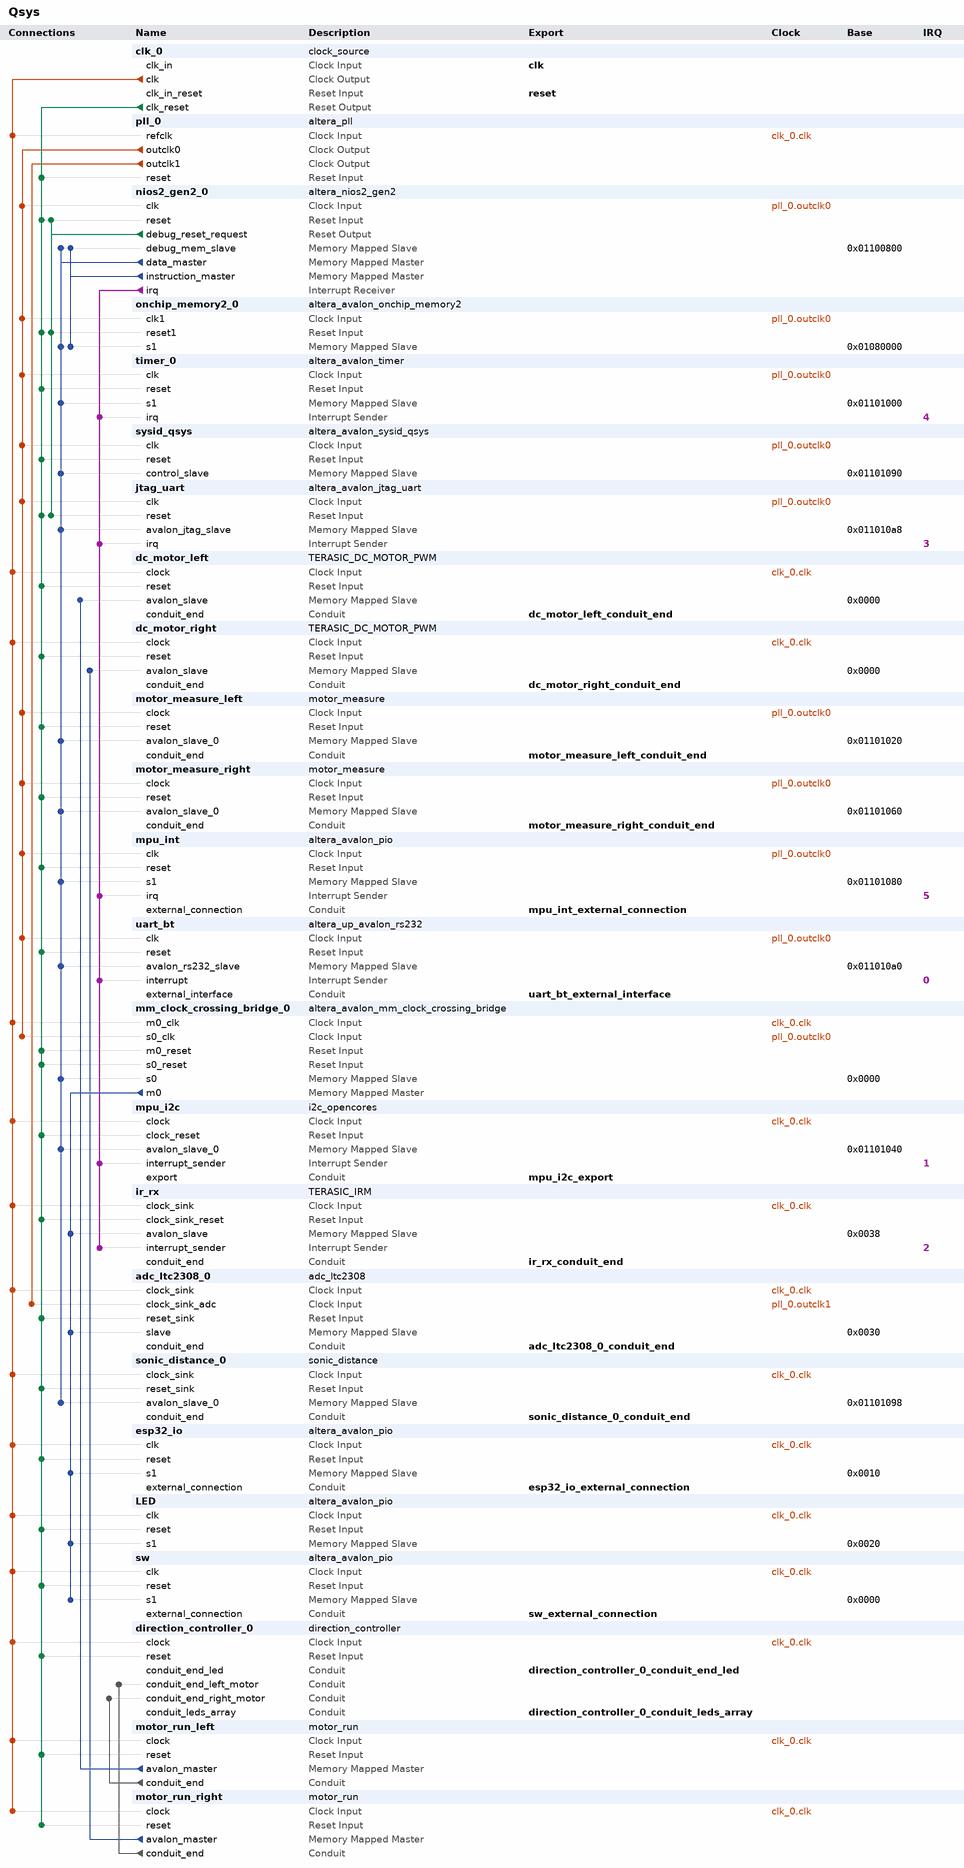
[diagram p0: system contents]
# Platform Designer (Qsys) system Qsys, Cyclone V 5CSEBA6U23I7
# Parameters at their usual value, and those the tool derives, are not listed.
package require -exact qsys 18.1
create_system Qsys
set_project_property DEVICE_FAMILY {Cyclone V}
set_project_property DEVICE 5CSEBA6U23I7

add_instance clk_0 clock_source 18.1
set_instance_parameter_value clk_0 clockFrequency 50000000

add_instance pll_0 altera_pll 18.1
set_instance_parameter_value pll_0 gui_device_speed_grade 2
set_instance_parameter_value pll_0 gui_number_of_clocks 2
set_instance_parameter_value pll_0 gui_operation_mode direct
set_instance_parameter_value pll_0 gui_output_clock_frequency0 100.0
set_instance_parameter_value pll_0 gui_output_clock_frequency1 40.0
set_instance_parameter_value pll_0 gui_pll_mode {Integer-N PLL}
set_instance_parameter_value pll_0 gui_reference_clock_frequency 50.0
set_instance_parameter_value pll_0 gui_use_locked true

add_instance nios2_gen2_0 altera_nios2_gen2 18.1
set_instance_parameter_value nios2_gen2_0 dcache_size 2048
set_instance_parameter_value nios2_gen2_0 exceptionSlave onchip_memory2_0.s1
set_instance_parameter_value nios2_gen2_0 icache_size 4096
set_instance_parameter_value nios2_gen2_0 impl Fast
set_instance_parameter_value nios2_gen2_0 resetSlave onchip_memory2_0.s1

add_instance onchip_memory2_0 altera_avalon_onchip_memory2 18.1
set_instance_parameter_value onchip_memory2_0 dataWidth 32
set_instance_parameter_value onchip_memory2_0 dualPort false
set_instance_parameter_value onchip_memory2_0 initMemContent true
set_instance_parameter_value onchip_memory2_0 initializationFileName onchip_mem.hex
set_instance_parameter_value onchip_memory2_0 memorySize 300000

add_instance timer_0 altera_avalon_timer 18.1
set_instance_parameter_value timer_0 period 1
set_instance_parameter_value timer_0 periodUnits MSEC

add_instance sysid_qsys altera_avalon_sysid_qsys 18.1
set_instance_parameter_value sysid_qsys id 0

add_instance jtag_uart altera_avalon_jtag_uart 18.1
set_instance_parameter_value jtag_uart simInteractiveOptions NO_INTERACTIVE_WINDOWS

add_instance dc_motor_left TERASIC_DC_MOTOR_PWM 2.0

add_instance dc_motor_right TERASIC_DC_MOTOR_PWM 2.0

add_instance motor_measure_left motor_measure 1.0

add_instance motor_measure_right motor_measure 1.0

add_instance mpu_int altera_avalon_pio 18.1
set_instance_parameter_value mpu_int captureEdge true
set_instance_parameter_value mpu_int direction Input
set_instance_parameter_value mpu_int generateIRQ true
set_instance_parameter_value mpu_int irqType EDGE
set_instance_parameter_value mpu_int width 1

add_instance uart_bt altera_up_avalon_rs232 17.1
set_instance_parameter_value uart_bt baud 115200
set_instance_parameter_value uart_bt parity None

add_instance mm_clock_crossing_bridge_0 altera_avalon_mm_clock_crossing_bridge 18.1
set_instance_parameter_value mm_clock_crossing_bridge_0 ADDRESS_WIDTH 10
set_instance_parameter_value mm_clock_crossing_bridge_0 COMMAND_FIFO_DEPTH 16
set_instance_parameter_value mm_clock_crossing_bridge_0 DATA_WIDTH 32
set_instance_parameter_value mm_clock_crossing_bridge_0 MASTER_SYNC_DEPTH 2
set_instance_parameter_value mm_clock_crossing_bridge_0 MAX_BURST_SIZE 1
set_instance_parameter_value mm_clock_crossing_bridge_0 RESPONSE_FIFO_DEPTH 16
set_instance_parameter_value mm_clock_crossing_bridge_0 SLAVE_SYNC_DEPTH 2
set_instance_parameter_value mm_clock_crossing_bridge_0 USE_AUTO_ADDRESS_WIDTH 1

add_instance mpu_i2c i2c_opencores 12.0

add_instance ir_rx TERASIC_IRM 1.0

add_instance adc_ltc2308_0 adc_ltc2308 1.1

add_instance sonic_distance_0 sonic_distance 1.0

add_instance esp32_io altera_avalon_pio 18.1
set_instance_parameter_value esp32_io direction Input
set_instance_parameter_value esp32_io width 3

add_instance LED altera_avalon_pio 18.1
set_instance_parameter_value LED direction Output
set_instance_parameter_value LED width 8

add_instance sw altera_avalon_pio 18.1
set_instance_parameter_value sw direction Input
set_instance_parameter_value sw width 4

add_instance direction_controller_0 direction_controller 1.0

add_instance motor_run_left motor_run 1.0

add_instance motor_run_right motor_run 1.0

# connections
add_connection clk_0.clk adc_ltc2308_0.clock_sink clock
add_connection clk_0.clk dc_motor_left.clock clock
add_connection clk_0.clk dc_motor_right.clock clock
add_connection clk_0.clk direction_controller_0.clock clock
add_connection clk_0.clk esp32_io.clk clock
add_connection clk_0.clk ir_rx.clock_sink clock
add_connection clk_0.clk LED.clk clock
add_connection clk_0.clk mm_clock_crossing_bridge_0.m0_clk clock
add_connection clk_0.clk motor_run_left.clock clock
add_connection clk_0.clk motor_run_right.clock clock
add_connection clk_0.clk mpu_i2c.clock clock
add_connection clk_0.clk pll_0.refclk clock
add_connection clk_0.clk sonic_distance_0.clock_sink clock
add_connection clk_0.clk sw.clk clock
add_connection pll_0.outclk0 jtag_uart.clk clock
add_connection pll_0.outclk0 mm_clock_crossing_bridge_0.s0_clk clock
add_connection pll_0.outclk0 motor_measure_left.clock clock
add_connection pll_0.outclk0 motor_measure_right.clock clock
add_connection pll_0.outclk0 mpu_int.clk clock
add_connection pll_0.outclk0 nios2_gen2_0.clk clock
add_connection pll_0.outclk0 onchip_memory2_0.clk1 clock
add_connection pll_0.outclk0 sysid_qsys.clk clock
add_connection pll_0.outclk0 timer_0.clk clock
add_connection pll_0.outclk0 uart_bt.clk clock
add_connection pll_0.outclk1 adc_ltc2308_0.clock_sink_adc clock
add_connection clk_0.clk_reset adc_ltc2308_0.reset_sink reset
add_connection clk_0.clk_reset dc_motor_left.reset reset
add_connection clk_0.clk_reset dc_motor_right.reset reset
add_connection clk_0.clk_reset direction_controller_0.reset reset
add_connection clk_0.clk_reset esp32_io.reset reset
add_connection clk_0.clk_reset ir_rx.clock_sink_reset reset
add_connection clk_0.clk_reset jtag_uart.reset reset
add_connection clk_0.clk_reset LED.reset reset
add_connection clk_0.clk_reset mm_clock_crossing_bridge_0.m0_reset reset
add_connection clk_0.clk_reset mm_clock_crossing_bridge_0.s0_reset reset
add_connection clk_0.clk_reset motor_measure_left.reset reset
add_connection clk_0.clk_reset motor_measure_right.reset reset
add_connection clk_0.clk_reset motor_run_left.reset reset
add_connection clk_0.clk_reset motor_run_right.reset reset
add_connection clk_0.clk_reset mpu_i2c.clock_reset reset
add_connection clk_0.clk_reset mpu_int.reset reset
add_connection clk_0.clk_reset nios2_gen2_0.reset reset
add_connection clk_0.clk_reset onchip_memory2_0.reset1 reset
add_connection clk_0.clk_reset pll_0.reset reset
add_connection clk_0.clk_reset sonic_distance_0.reset_sink reset
add_connection clk_0.clk_reset sw.reset reset
add_connection clk_0.clk_reset sysid_qsys.reset reset
add_connection clk_0.clk_reset timer_0.reset reset
add_connection clk_0.clk_reset uart_bt.reset reset
add_connection nios2_gen2_0.debug_reset_request jtag_uart.reset reset
add_connection nios2_gen2_0.debug_reset_request nios2_gen2_0.reset reset
add_connection nios2_gen2_0.debug_reset_request onchip_memory2_0.reset1 reset
add_connection mm_clock_crossing_bridge_0.m0 adc_ltc2308_0.slave avalon
set_connection_parameter_value mm_clock_crossing_bridge_0.m0/adc_ltc2308_0.slave baseAddress 0x0030
add_connection mm_clock_crossing_bridge_0.m0 esp32_io.s1 avalon
set_connection_parameter_value mm_clock_crossing_bridge_0.m0/esp32_io.s1 baseAddress 0x0010
add_connection mm_clock_crossing_bridge_0.m0 ir_rx.avalon_slave avalon
set_connection_parameter_value mm_clock_crossing_bridge_0.m0/ir_rx.avalon_slave baseAddress 0x0038
add_connection mm_clock_crossing_bridge_0.m0 LED.s1 avalon
set_connection_parameter_value mm_clock_crossing_bridge_0.m0/LED.s1 baseAddress 0x0020
add_connection mm_clock_crossing_bridge_0.m0 sw.s1 avalon
set_connection_parameter_value mm_clock_crossing_bridge_0.m0/sw.s1 baseAddress 0x0000
add_connection motor_run_left.avalon_master dc_motor_left.avalon_slave avalon
set_connection_parameter_value motor_run_left.avalon_master/dc_motor_left.avalon_slave baseAddress 0x0000
add_connection motor_run_right.avalon_master dc_motor_right.avalon_slave avalon
set_connection_parameter_value motor_run_right.avalon_master/dc_motor_right.avalon_slave baseAddress 0x0000
add_connection nios2_gen2_0.data_master jtag_uart.avalon_jtag_slave avalon
set_connection_parameter_value nios2_gen2_0.data_master/jtag_uart.avalon_jtag_slave baseAddress 0x011010a8
add_connection nios2_gen2_0.data_master mm_clock_crossing_bridge_0.s0 avalon
set_connection_parameter_value nios2_gen2_0.data_master/mm_clock_crossing_bridge_0.s0 baseAddress 0x0000
add_connection nios2_gen2_0.data_master motor_measure_left.avalon_slave_0 avalon
set_connection_parameter_value nios2_gen2_0.data_master/motor_measure_left.avalon_slave_0 baseAddress 0x01101020
add_connection nios2_gen2_0.data_master motor_measure_right.avalon_slave_0 avalon
set_connection_parameter_value nios2_gen2_0.data_master/motor_measure_right.avalon_slave_0 baseAddress 0x01101060
add_connection nios2_gen2_0.data_master mpu_i2c.avalon_slave_0 avalon
set_connection_parameter_value nios2_gen2_0.data_master/mpu_i2c.avalon_slave_0 baseAddress 0x01101040
add_connection nios2_gen2_0.data_master mpu_int.s1 avalon
set_connection_parameter_value nios2_gen2_0.data_master/mpu_int.s1 baseAddress 0x01101080
add_connection nios2_gen2_0.data_master nios2_gen2_0.debug_mem_slave avalon
set_connection_parameter_value nios2_gen2_0.data_master/nios2_gen2_0.debug_mem_slave baseAddress 0x01100800
add_connection nios2_gen2_0.data_master onchip_memory2_0.s1 avalon
set_connection_parameter_value nios2_gen2_0.data_master/onchip_memory2_0.s1 baseAddress 0x01080000
add_connection nios2_gen2_0.data_master sonic_distance_0.avalon_slave_0 avalon
set_connection_parameter_value nios2_gen2_0.data_master/sonic_distance_0.avalon_slave_0 baseAddress 0x01101098
add_connection nios2_gen2_0.data_master sysid_qsys.control_slave avalon
set_connection_parameter_value nios2_gen2_0.data_master/sysid_qsys.control_slave baseAddress 0x01101090
add_connection nios2_gen2_0.data_master timer_0.s1 avalon
set_connection_parameter_value nios2_gen2_0.data_master/timer_0.s1 baseAddress 0x01101000
add_connection nios2_gen2_0.data_master uart_bt.avalon_rs232_slave avalon
set_connection_parameter_value nios2_gen2_0.data_master/uart_bt.avalon_rs232_slave baseAddress 0x011010a0
add_connection nios2_gen2_0.instruction_master nios2_gen2_0.debug_mem_slave avalon
set_connection_parameter_value nios2_gen2_0.instruction_master/nios2_gen2_0.debug_mem_slave baseAddress 0x01100800
add_connection nios2_gen2_0.instruction_master onchip_memory2_0.s1 avalon
set_connection_parameter_value nios2_gen2_0.instruction_master/onchip_memory2_0.s1 baseAddress 0x01080000
add_connection motor_run_left.conduit_end direction_controller_0.conduit_end_right_motor conduit
add_connection motor_run_right.conduit_end direction_controller_0.conduit_end_left_motor conduit
add_connection nios2_gen2_0.irq ir_rx.interrupt_sender interrupt
set_connection_parameter_value nios2_gen2_0.irq/ir_rx.interrupt_sender irqNumber 2
add_connection nios2_gen2_0.irq jtag_uart.irq interrupt
set_connection_parameter_value nios2_gen2_0.irq/jtag_uart.irq irqNumber 3
add_connection nios2_gen2_0.irq mpu_i2c.interrupt_sender interrupt
set_connection_parameter_value nios2_gen2_0.irq/mpu_i2c.interrupt_sender irqNumber 1
add_connection nios2_gen2_0.irq mpu_int.irq interrupt
set_connection_parameter_value nios2_gen2_0.irq/mpu_int.irq irqNumber 5
add_connection nios2_gen2_0.irq timer_0.irq interrupt
set_connection_parameter_value nios2_gen2_0.irq/timer_0.irq irqNumber 4
add_connection nios2_gen2_0.irq uart_bt.interrupt interrupt
set_connection_parameter_value nios2_gen2_0.irq/uart_bt.interrupt irqNumber 0

# exported interfaces
add_interface adc_ltc2308_0_conduit_end conduit end
set_interface_property adc_ltc2308_0_conduit_end EXPORT_OF adc_ltc2308_0.conduit_end
add_interface clk clock sink
set_interface_property clk EXPORT_OF clk_0.clk_in
add_interface dc_motor_left_conduit_end conduit end
set_interface_property dc_motor_left_conduit_end EXPORT_OF dc_motor_left.conduit_end
add_interface dc_motor_right_conduit_end conduit end
set_interface_property dc_motor_right_conduit_end EXPORT_OF dc_motor_right.conduit_end
add_interface direction_controller_0_conduit_end_led conduit end
set_interface_property direction_controller_0_conduit_end_led EXPORT_OF direction_controller_0.conduit_end_led
add_interface direction_controller_0_conduit_leds_array conduit end
set_interface_property direction_controller_0_conduit_leds_array EXPORT_OF direction_controller_0.conduit_leds_array
add_interface esp32_io_external_connection conduit end
set_interface_property esp32_io_external_connection EXPORT_OF esp32_io.external_connection
add_interface ir_rx_conduit_end conduit end
set_interface_property ir_rx_conduit_end EXPORT_OF ir_rx.conduit_end
add_interface motor_measure_left_conduit_end conduit end
set_interface_property motor_measure_left_conduit_end EXPORT_OF motor_measure_left.conduit_end
add_interface motor_measure_right_conduit_end conduit end
set_interface_property motor_measure_right_conduit_end EXPORT_OF motor_measure_right.conduit_end
add_interface mpu_i2c_export conduit end
set_interface_property mpu_i2c_export EXPORT_OF mpu_i2c.export
add_interface mpu_int_external_connection conduit end
set_interface_property mpu_int_external_connection EXPORT_OF mpu_int.external_connection
add_interface reset reset sink
set_interface_property reset EXPORT_OF clk_0.clk_in_reset
add_interface sonic_distance_0_conduit_end conduit end
set_interface_property sonic_distance_0_conduit_end EXPORT_OF sonic_distance_0.conduit_end
add_interface sw_external_connection conduit end
set_interface_property sw_external_connection EXPORT_OF sw.external_connection
add_interface uart_bt_external_interface conduit end
set_interface_property uart_bt_external_interface EXPORT_OF uart_bt.external_interface

set_interconnect_requirement {$system} qsys_mm.clockCrossingAdapter HANDSHAKE
set_interconnect_requirement {$system} qsys_mm.enableEccProtection FALSE
set_interconnect_requirement {$system} qsys_mm.insertDefaultSlave FALSE
set_interconnect_requirement {$system} qsys_mm.maxAdditionalLatency 1

save_system Qsys.qsys
